# Altium project CTR-Dome-Rev-A.PrjPcb
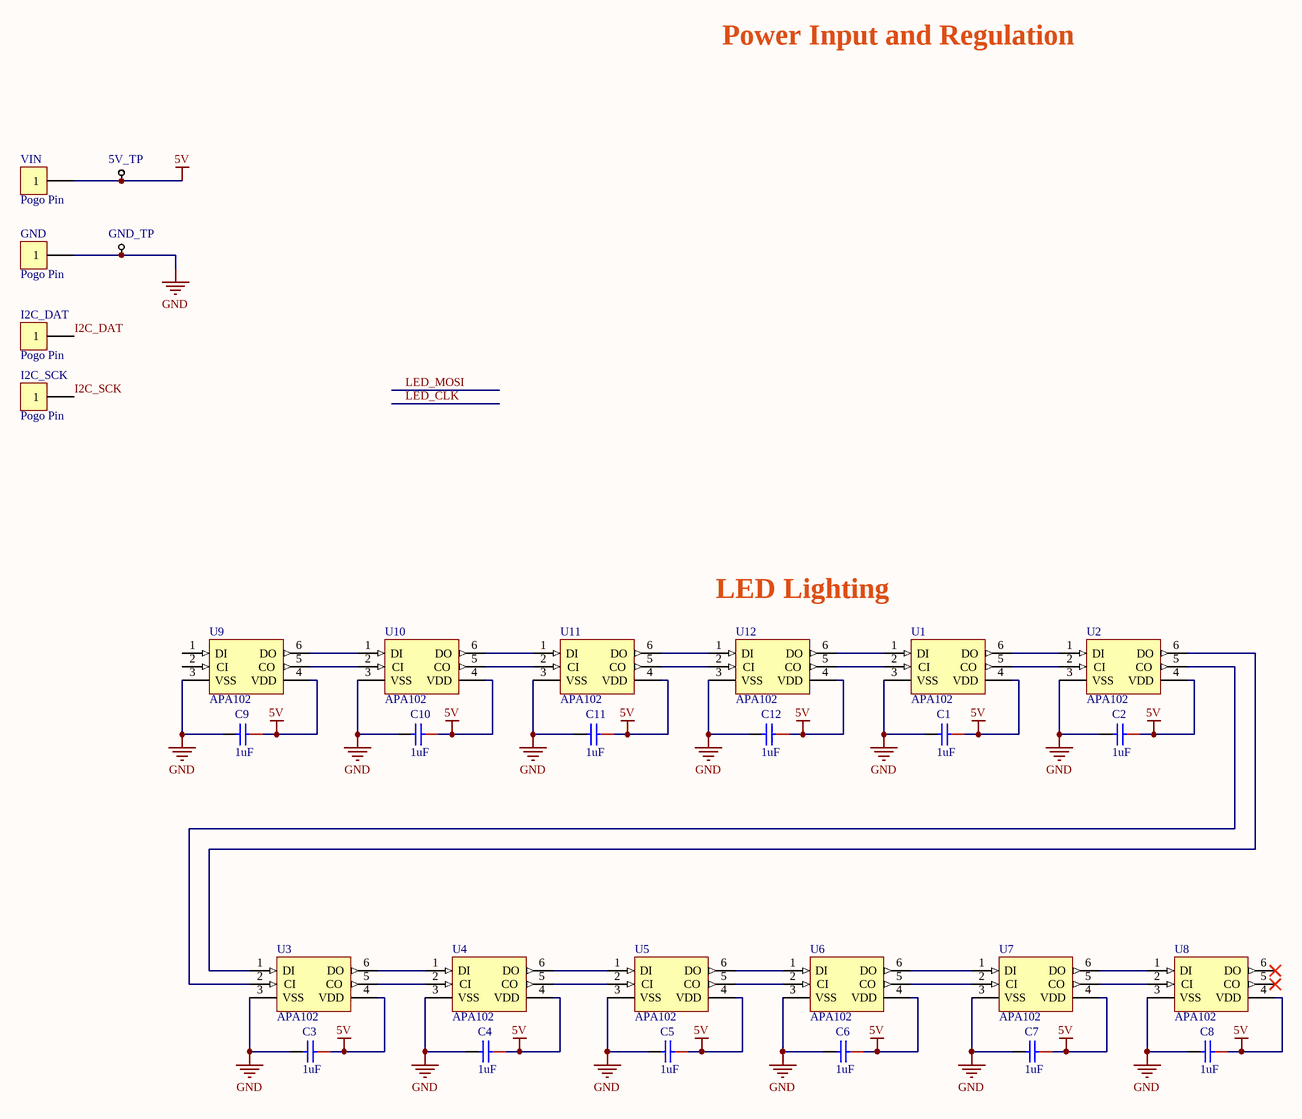
[diagram p0: CTR-Dome-Rev-A-Leds-1.SchDoc]
1 sheet, 30 parts. Net scope: hierarchical (ports join the sheet entries above them; power ports are global).
Board file: CTR-Dome-Rev-A.PcbDoc

## Sheet CTR-Dome-Rev-A-Leds-1.SchDoc: ZoZbots Dome Board
size B; Author: RMG; Organization: OLogic, Inc.; DocumentNumber: 112216; Revision: B; SheetNumber: 1; SheetTotal: 1; PageSetup: Record=PageOptions|CenterHorizontal=True|CenterVertical=True|PrintScale=0.70|XCorrection=1.00|YCorrection=1.00|PrintKind=0|BorderSize=5000000|LeftOffset=0|BottomOffset=0|Orientation=2|PaperLength=1000|PaperWidth=1000|Scale=100|PaperSource=15|PrintQuality=600|MediaType=1|DitherType=10|PrintScaleMode=1|PaperKind=Letter|PaperIndex=1

### Parts
5V_TP  Test Point  [TestPoint-TH 42 mil]  (value not drawn)
C1  1uF  [CAPC0402(1005)_N]
C2  1uF  [CAPC0402(1005)_N]
C3  1uF  [CAPC0402(1005)_N]
C4  1uF  [CAPC0402(1005)_N]
C5  1uF  [CAPC0402(1005)_N]
C6  1uF  [CAPC0402(1005)_N]
C7  1uF  [CAPC0402(1005)_N]
C8  1uF  [CAPC0402(1005)_N]
C9  1uF  [CAPC0402(1005)_N]
C10  1uF  [CAPC0402(1005)_N]
C11  1uF  [CAPC0402(1005)_N]
C12  1uF  [CAPC0402(1005)_N]
GND  Pogo Pin  [POGO_PIN]
GND_TP  Test Point  [TestPoint-TH 42 mil]  (value not drawn)
I2C_DAT  Pogo Pin  [POGO_PIN]
I2C_SCK  Pogo Pin  [POGO_PIN]
U1  APA102  [APA102C]
U2  APA102  [APA102C]
U3  APA102  [APA102C]
U4  APA102  [APA102C]
U5  APA102  [APA102C]
U6  APA102  [APA102C]
U7  APA102  [APA102C]
U8  APA102  [APA102C]
U9  APA102  [APA102C]
U10  APA102  [APA102C]
U11  APA102  [APA102C]
U12  APA102  [APA102C]
VIN  Pogo Pin  [POGO_PIN]

### Nets
5V: 5V_TP.1 C1.1 C2.1 C3.1 C4.1 C5.1 C6.1 C7.1 C8.1 C9.1 C10.1 C11.1 C12.1 U1.4(VDD) U2.4(VDD) U3.4(VDD) U4.4(VDD) U5.4(VDD) U6.4(VDD) U7.4(VDD) U8.4(VDD) U9.4(VDD) U10.4(VDD) U11.4(VDD) U12.4(VDD) VIN.1
GND: C1.2 C2.2 C3.2 C4.2 C5.2 C6.2 C7.2 C8.2 C9.2 C10.2 C11.2 C12.2 GND.1 GND_TP.1 U1.3(VSS) U2.3(VSS) U3.3(VSS) U4.3(VSS) U5.3(VSS) U6.3(VSS) U7.3(VSS) U8.3(VSS) U9.3(VSS) U10.3(VSS) U11.3(VSS) U12.3(VSS)
I2C_DAT: I2C_DAT.1
I2C_SCK: I2C_SCK.1
NetU1_1: U1.1(DI) U12.6(DO)
NetU1_2: U1.2(CI) U12.5(CO)
NetU1_5: U1.5(CO) U2.2(CI)
NetU1_6: U1.6(DO) U2.1(DI)
NetU2_5: U2.5(CO) U3.2(CI)
NetU2_6: U2.6(DO) U3.1(DI)
NetU3_5: U3.5(CO) U4.2(CI)
NetU3_6: U3.6(DO) U4.1(DI)
NetU4_5: U4.5(CO) U5.2(CI)
NetU4_6: U4.6(DO) U5.1(DI)
NetU5_5: U5.5(CO) U6.2(CI)
NetU5_6: U5.6(DO) U6.1(DI)
NetU6_5: U6.5(CO) U7.2(CI)
NetU6_6: U6.6(DO) U7.1(DI)
NetU7_5: U7.5(CO) U8.2(CI)
NetU7_6: U7.6(DO) U8.1(DI)
NetU9_5: U9.5(CO) U10.2(CI)
NetU9_6: U9.6(DO) U10.1(DI)
NetU10_5: U10.5(CO) U11.2(CI)
NetU10_6: U10.6(DO) U11.1(DI)
NetU11_5: U11.5(CO) U12.2(CI)
NetU11_6: U11.6(DO) U12.1(DI)

Not connected (* = marked no-connect by the designer): U8 5(CO)* 6(DO)*; U9 1(DI) 2(CI)

### Notes on the sheet
- Power Input and Regulation
- LED Lighting
- Title
- By:
- Date:
- Number:
- Time:
- Revision:
- Sheet
- of
- OLogic, Inc.
- 1394 Borregas Ave.
- Sunnyvale, CA
- 94089 USA
- File:
- (650) 996-1490

### Library data of the parts
5V_TP GND_TP = TestPoint, small: ClassName: IMU
C1-C12 = CAP CER 1UF 16V 10% X5R 0402: 1UF 0402; Manufacturer: TDK Corporation; Manufacturer Part Number: C1005X5R1C105K050BC; Capacitance: 1.0µF; Tolerance: ±10%; Voltage - Rated: 16V; Temperature Coefficient: X5R; ClassName: LED; Supplier 1: Digi-Key; RoHS: RoHS Compliant; Category: Capacitors; Stock 1: 490204; Pricing 1: 1=0.12, 10=0.08, 100=0.038, 250=0.032, 500=0.0268, 1000=0.022, 5000=0.0186 (USD); Packaging: Cut Tape (CT); Mounting Type: Surface Mount, MLCC; Operating Temperature: -55°C ~ 85°C; Applications: General Purpose; Ratings: -; Package / Case: 0402 (1005 Metric); Size / Dimension: 0.039" L x 0.020" W (1.00mm x 0.50mm); Height - Seated (Max): -; Thickness (Max): 0.022" (0.55mm); Lead Spacing: -; Features: -; Lead Style: -; ComponentLink1URL: http://product.tdk.com/en/catalog/datasheets/mlcc_commercial_general_en.pdf; ComponentLink1Description: http://product.tdk.com/en/catalog/datasheets/mlcc_commercial_general_en.pdf; Supplier Part Number 1: 445-4978-1-ND
GND I2C_DAT I2C_SCK VIN = 0850-0-15-20-83-14-11-0: Manufacturer: Mill-Max Manufacturing Corp.; Plating: Gold; Plating - Thickness: 20µin (0.51µm); Supplier 1: Digi-Key; Manufacturer Part Number: 0850-0-15-20-83-14-11-0; RoHS: RoHS Compliant; Category: Connectors, Interconnects; Stock 1: 38651; Pricing 1: 1=1.89, 10=1.47, 25=1.3708, 50=1.246, 100=1.1214, 250=0.94696, 500=0.89712, 1000=0.79744, 2500=0.66287 (USD); Part Status: Active; Material: Copper Alloy; Mounting Type: Through Hole; ComponentLink1URL: http://www.mill-max.com/assets/pdfs/028.pdf; ComponentLink1Description: http://www.mill-max.com/assets/pdfs/028.pdf; Supplier Part Number 1: ED90436-ND
U1-U12 = APA102: APA102 RGB LED with serial controller; Manufacturer: Shiji Lighting; MPN: APA102C; ClassName: LED